# EAGLE design openhum2 (EAGLE 6.5.0)
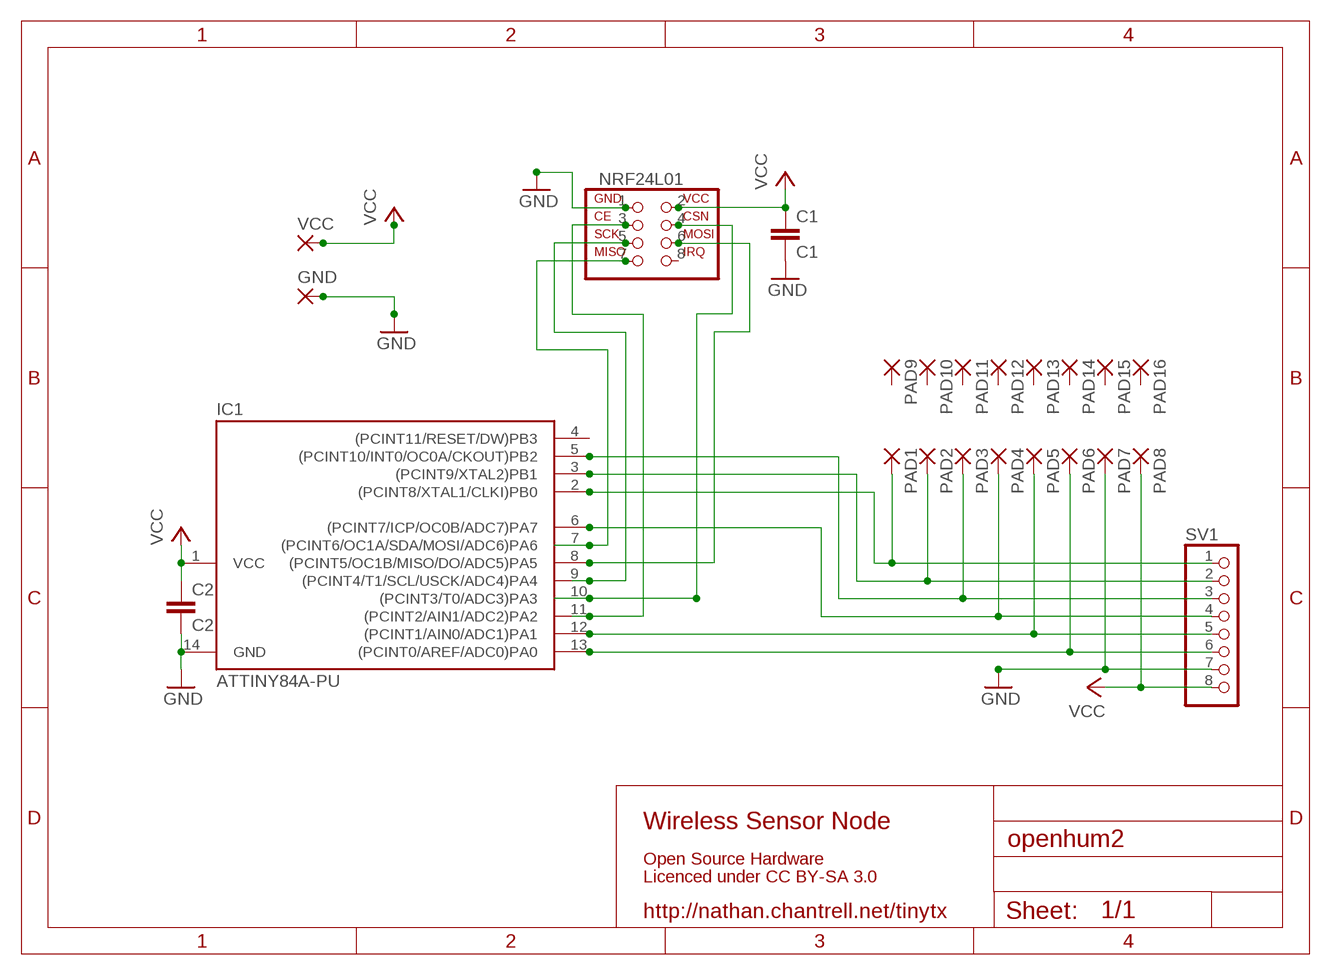
[diagram p0: schematic, sheet 1]

## Parts
C1  C1  C-EU025-025X050  [C025-025X050]
C2  C2  C-EU025-025X050  [C025-025X050]
GND  2,15/1,0  [2,15/1,0]
IC1  ATTINY84A-PU  TINY24/44/84-PU  [DIL14]
NRF24L01  NRF24L01+  [NRF24L01+]
PAD1  1,6/0,9  [1,6/0,9]
PAD2  1,6/0,9  [1,6/0,9]
PAD3  1,6/0,9  [1,6/0,9]
PAD4  1,6/0,9  [1,6/0,9]
PAD5  1,6/0,9  [1,6/0,9]
PAD6  1,6/0,9  [1,6/0,9]
PAD7  1,6/0,9  [1,6/0,9]
PAD8  1,6/0,9  [1,6/0,9]
PAD9  1,6/0,9  [1,6/0,9]
PAD10  1,6/0,9  [1,6/0,9]
PAD11  1,6/0,9  [1,6/0,9]
PAD12  1,6/0,9  [1,6/0,9]
PAD13  1,6/0,9  [1,6/0,9]
PAD14  1,6/0,9  [1,6/0,9]
PAD15  1,6/0,9  [1,6/0,9]
PAD16  1,6/0,9  [1,6/0,9]
SV1  PINHD-1X8  [1X08]
VCC  2,15/1,0  [2,15/1,0]

## Nets
GND: C1.2 C2.2 GND.1(P) IC1.14(GND) NRF24L01.1 PAD7.1(P) SV1.7
N$1: IC1.11((PCINT2/AIN1/ADC2)PA2) NRF24L01.3
N$2: IC1.10((PCINT3/T0/ADC3)PA3) NRF24L01.4
N$3: IC1.9((PCINT4/T1/SCL/USCK/ADC4)PA4) NRF24L01.5
N$4: IC1.7((PCINT6/OC1A/SDA/MOSI/ADC6)PA6) NRF24L01.7
N$6: IC1.5((PCINT10/INT0/OC0A/CKOUT)PB2) PAD3.1(P) SV1.3
N$7: IC1.3((PCINT9/XTAL2)PB1) PAD2.1(P) SV1.2
N$9: IC1.13((PCINT0/AREF/ADC0)PA0) PAD6.1(P) SV1.6
N$10: IC1.12((PCINT1/AIN0/ADC1)PA1) PAD5.1(P) SV1.5
N$11: IC1.8((PCINT5/OC1B/MISO/DO/ADC5)PA5) NRF24L01.6
N$12: IC1.2((PCINT8/XTAL1/CLKI)PB0) PAD1.1(P) SV1.1
N$15: IC1.6((PCINT7/ICP/OC0B/ADC7)PA7) PAD4.1(P) SV1.4
VCC: C1.1 C2.1 IC1.1(VCC) NRF24L01.2 PAD8.1(P) SV1.8 VCC.1(P)
Unconnected: IC1.4((PCINT11/RESET/DW)PB3) NRF24L01.8 PAD9.1(P) PAD10.1(P) PAD11.1(P) PAD12.1(P) PAD13.1(P) PAD14.1(P) PAD15.1(P) PAD16.1(P)

## Notes on the sheet
- Wireless Sensor Node
- Open Source Hardware
- Licenced under CC BY-SA 3.0
- http://nathan.chantrell.net/tinytx

## Library data of the parts
C1 C2 = rcl:C-EU: CAPACITOR, European symbol
GND VCC = wirepad:2,15/1,0: THROUGH-HOLE PAD
IC1 = avr-5:TINY24/44/84
NRF24L01 = MTS_Custom:NRF24L01+
PAD1-PAD16 = wirepad:1,6/0,9: THROUGH-HOLE PAD
SV1 = pinhead:PINHD-1X8: PIN HEADER

## Net classes
1 power: width 0.6 mm, clearance 0.3 mm

## Board
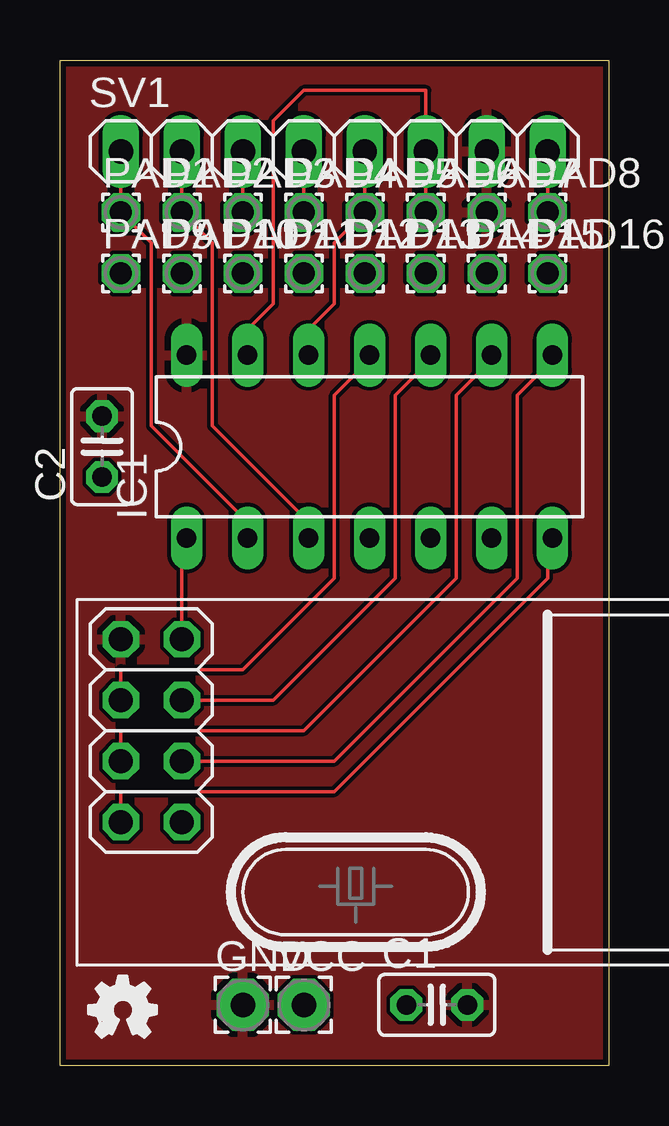
[diagram p1: board, top side]
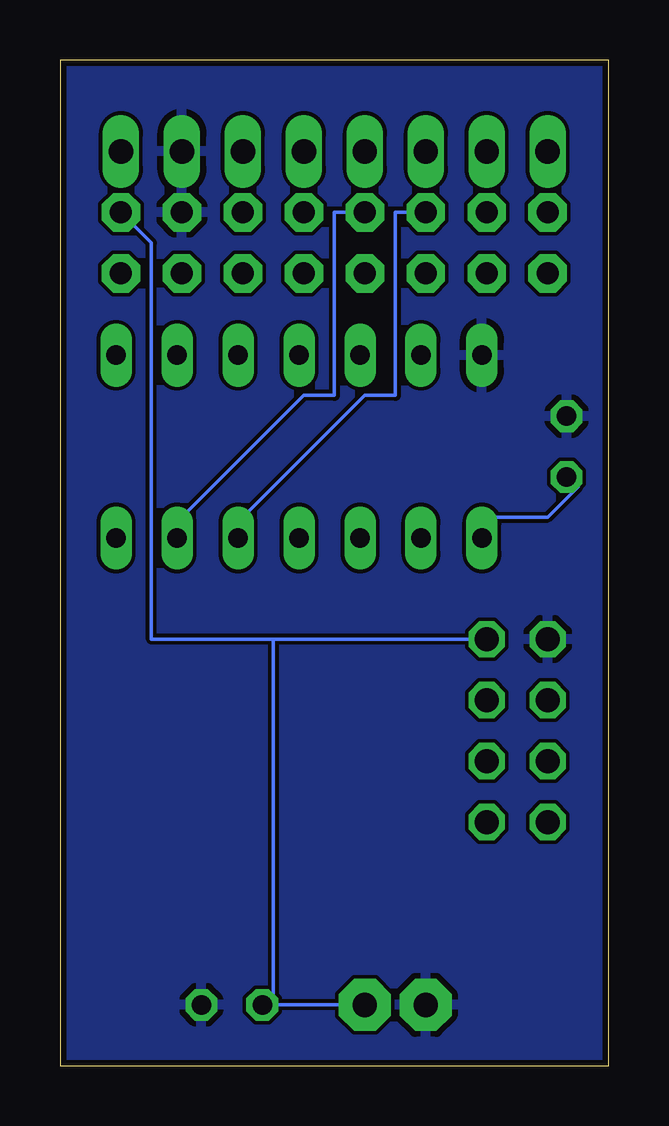
[diagram p2: board, bottom side, seen from below]

Size 22.86 x 41.91 mm. Coordinates in mm from the lower left corner, seen from the top.
Outline: 0,41.91 22.86,41.91 22.86,0 0,0 0,41.91
Copper layers (1*16): Top 0.035mm / dielectric 1.5mm / Bottom 0.035mm
Design rules "SeeedStudio_2layer_DRU_no_angle_20140221": minimum track width 6mil, minimum drill 12mil, track to track 6mil, track to pad 6mil, pad to pad 6mil, via to via 6mil, smd to smd 0mil, copper to edge 10mil, drill to drill 10mil, minimum pad ring 10mil, minimum via ring 6mil, stop-mask expansion 2mil, vias tented up to drill 100mil, thermal gap 10mil

### Footprints (pad centres in the part's own frame; a part is rotated, then mirrored left to right if it is on the bottom)
C025-025X050 = drill 0.813 octagon: 1 -1.27,0; 2 1.27,0
2,15/1,0 = drill 1.016 pad 2.159 octagon: 1 0,0
DIL14 = drill 0.813 long: 1 -7.62,-3.81; 2 -5.08,-3.81; 3 -2.54,-3.81; 4 0,-3.81; 5 2.54,-3.81; 6 5.08,-3.81; 7 7.62,-3.81; 8 7.62,3.81; 9 5.08,3.81; 10 2.54,3.81; 11 0,3.81; 12 -2.54,3.81; 13 -5.08,3.81; 14 -7.62,3.81
NRF24L01+ = drill 1 octagon: 1 -5.08,-12.7; 2 -5.08,-10.16; 3 -2.54,-12.7; 4 -2.54,-10.16; 5 0,-12.7; 6 0,-10.16; 7 2.54,-12.7; 8 2.54,-10.16
1,6/0,9 = drill 0.914 pad 1.6 octagon: 1 0,0
1X08 = drill 1.016 long: 1 -8.89,0; 2 -6.35,0; 3 -3.81,0; 4 -1.27,0; 5 1.27,0; 6 3.81,0; 7 6.35,0; 8 8.89,0

### Placement (x,y rotation side)
C1  15.7,2.54 0 top
C2  1.75,25.8 90 top
GND  7.62,2.54 0 top
IC1  12.9,25.8 0 top
NRF24L01  15.24,12.7 270 top
PAD1  2.54,35.56 0 top
PAD2  5.08,35.56 0 top
PAD3  7.62,35.56 0 top
PAD4  10.16,35.56 0 top
PAD5  12.7,35.56 0 top
PAD6  15.24,35.56 0 top
PAD7  17.78,35.56 0 top
PAD8  20.32,35.56 0 top
PAD9  2.54,33.02 0 top
PAD10  5.08,33.02 0 top
PAD11  7.62,33.02 0 top
PAD12  10.16,33.02 0 top
PAD13  12.7,33.02 0 top
PAD14  15.24,33.02 0 top
PAD15  17.78,33.02 0 top
PAD16  20.32,33.02 0 top
SV1  11.43,38.1 0 top
U$2  [OSHW_FILLX100_NOTEXT]  1.2,1.2 0 top
VCC  10.16,2.54 0 top

### Tracks (layer width: path | path; a pad name or v marks a point on that pad's centre or on a via)
GND
  pour Bottom: 0,41.91 22.86,41.91 22.86,0 0,0
  pour Top: 0,41.91 22.86,41.91 22.86,0 0,0
N$1
  Top 0.152: NRF24L01.3 2.54,16.51 7.62,16.51 11.43,20.32 11.43,27.94 12.7,29.21 IC1.11
N$2
  Top 0.152: NRF24L01.4 8.89,15.24 13.97,20.32 13.97,27.94 15.24,29.21 IC1.10
N$3
  Top 0.152: NRF24L01.5 2.54,13.97 10.16,13.97 16.51,20.32 16.51,27.94 17.78,29.21 IC1.9
N$4
  Top 0.152: NRF24L01.7 2.54,11.43 11.43,11.43 20.32,20.32 20.32,21.59 IC1.7
N$6
  Top 0.152: PAD3.1 SV1.3
  Bottom 0.152: PAD3.1 8.89,35.56 8.89,27.94 10.16,27.94 15.24,22.86 IC1.5
N$7
  Top 0.152: IC1.3 10.16,22.86 6.35,26.67 6.35,34.29 PAD2.1 SV1.2
N$9
  Top 0.152: IC1.13 7.62,30.48 8.89,31.75 8.89,39.37 10.16,40.64 15.24,40.64 SV1.6 PAD6.1
N$10
  Top 0.152: IC1.12 10.16,30.48 11.43,31.75 11.43,34.29 PAD5.1 SV1.5
N$11
  Top 0.152: NRF24L01.6 11.43,12.7 19.05,20.32 19.05,27.94 20.32,29.21 IC1.8
N$12
  Top 0.152: IC1.2 7.62,22.86 3.81,26.67 3.81,34.29 PAD1.1 SV1.1
N$15
  Top 0.152: PAD4.1 SV1.4
  Bottom 0.152: PAD4.1 11.43,35.56 11.43,27.94 12.7,27.94 17.78,22.86 IC1.6
VCC
  Top 0.152: PAD8.1 SV1.8 | NRF24L01.2 5.08,21.59 IC1.1
  Bottom 0.152: VCC.1 13.97,2.54 | C2.1 1.27,24.13 2.54,22.86 5.08,22.86 IC1.1 | PAD8.1 19.05,34.29 19.05,17.78 13.97,17.78 | NRF24L01.2 13.97,17.78 | 13.97,17.78 13.97,2.54 | 13.97,2.54 C1.1

### Text on the board
_tsilk: 0 | 1 | 2 | 3 | 9 | 10 | GND | VCC | NRF24L01 | GND | VCC
_bsilk: Node no | TinyTX3 | http://zorg.org/ttx3